# Altium schematic sheet Block_diagram.SchDoc
size A4; SheetNumber: 1; SheetTotal: 1
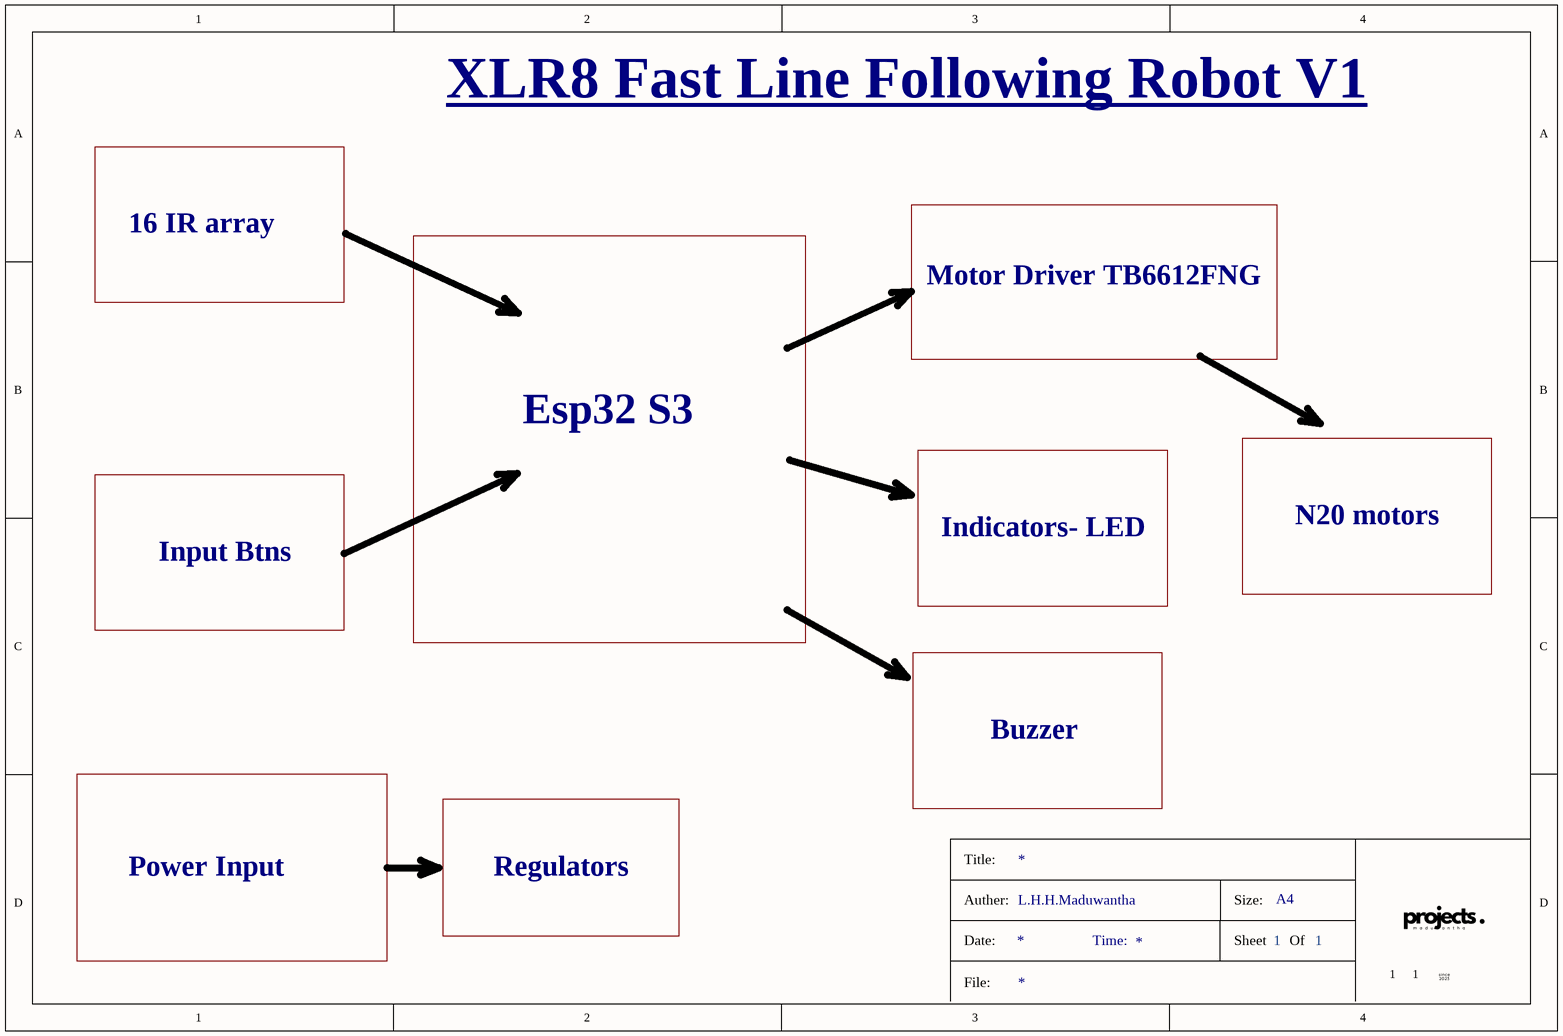
[diagram p0: Block_diagram.SchDoc]

## Notes on the sheet
- XLR8 Fast Line Following Robot V1
- 16 IR array
- Motor Driver TB6612FNG
- Esp32 S3
- Input Btns
- Indicators- LED
- N20 motors
- Buzzer
- Power Input
- Regulators
- Title:
- Auther:
- L.H.H.Maduwantha
- Size:
- A4
- Date:
- File:
- Time:
- Sheet
- Of